# Altium schematic sheet FDCAN.SchDoc: FDCAN
size A4; Date: Not used; ApprovedBy: Not used; CheckedBy: Not used; Author: Not used; CompanyName: STMicroelectronics; DrawnBy: Not used; Engineer: Not used; Organization: Not used; Address1: Not used; Address2: Not used; Address3: Not used; Address4: Not used; DocumentNumber: Not used; Revision: Not used; SheetNumber: 12; SheetTotal: 22; CurrentTime: Not used; CurrentDate: Not used; Time: Not used; DocumentFullPathAndName: Not used; DocumentName: Not used; ModifiedDate: Not used; ImagePath: Not used; ProjectName: Not used; Application_BuildNumber: Not used
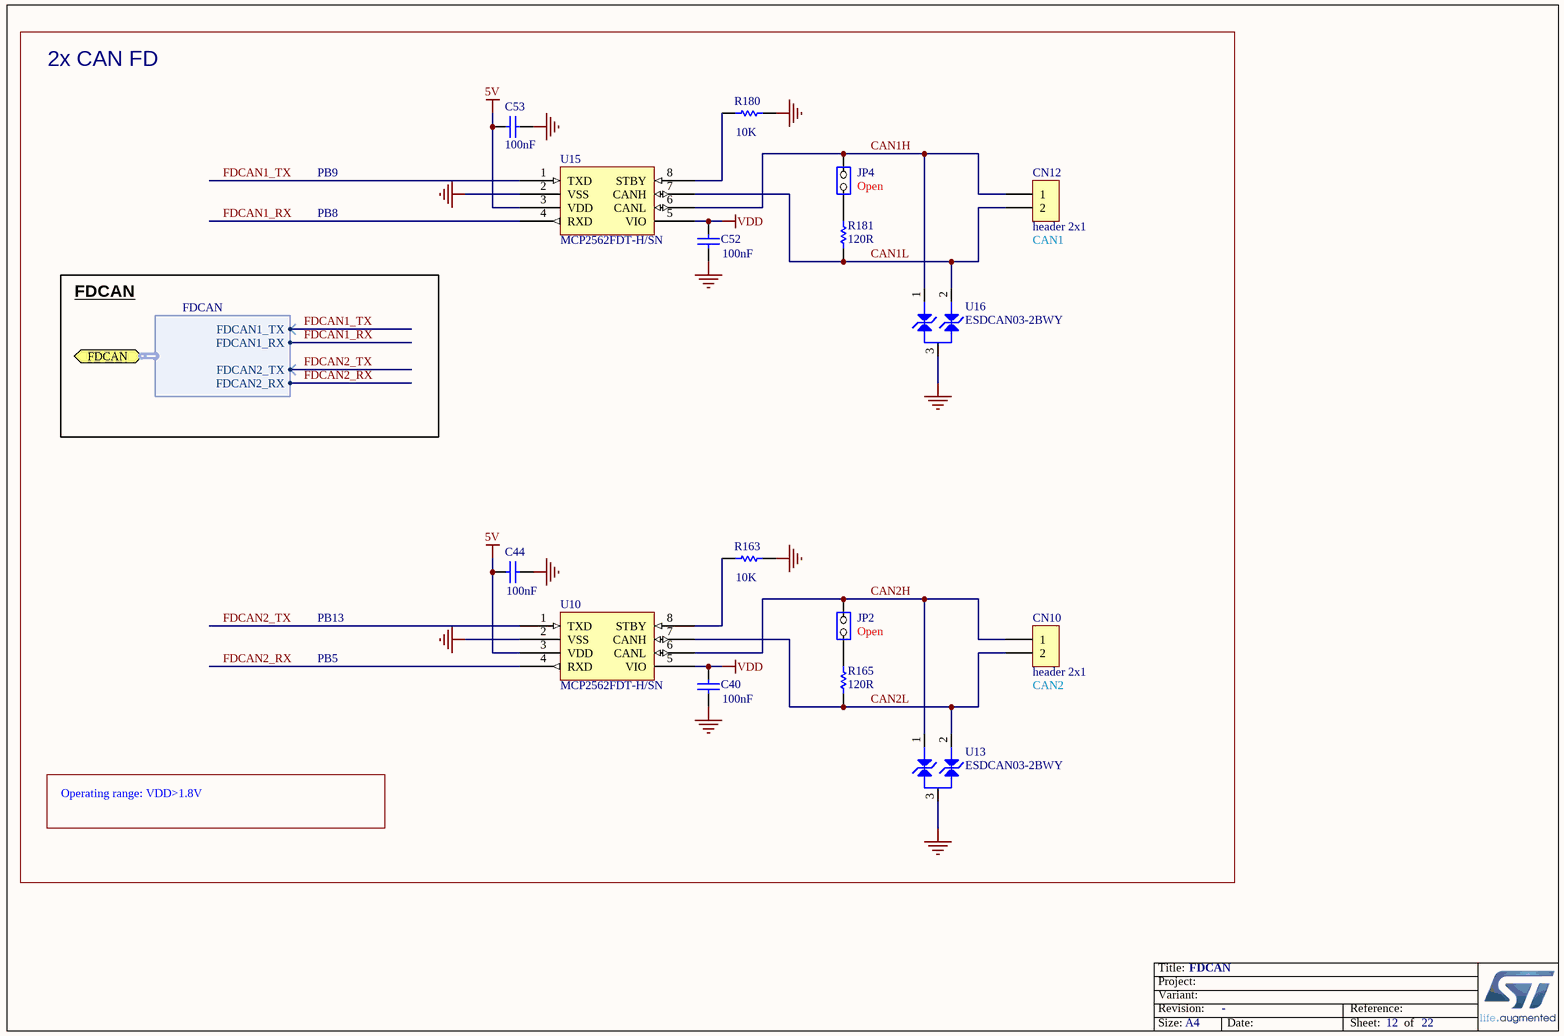
[diagram p0: FDCAN.SchDoc]

## Parts
C40  value 100nF  [C0402]  (hidden comment: Capacitor)
C44  value 100nF  [C0402]  (hidden comment: Capacitor)
C52  value 100nF  [C0402]  (hidden comment: Capacitor)
C53  value 100nF  [C0402]  (hidden comment: Capacitor)
CN10  Header 2x1  [CON_988-JIUBABA_PHFS25-11-02-G0B115-T-1]
CN12  Header 2x1  [CON_988-JIUBABA_PHFS25-11-02-G0B115-T-1]
JP2  Jumper_Header 2x1  [CON_SAMTEC_TSW-102-07-G-S]  (value not drawn)
JP4  Jumper_Header 2x1  [CON_SAMTEC_TSW-102-07-G-S]  (value not drawn)
R163  value 10K  [R0402]  (hidden comment: Resistor)
R165  value 120R  [R0603]  (hidden comment: Resistor)
R180  value 10K  [R0402]  (hidden comment: Resistor)
R181  value 120R  [R0603]  (hidden comment: Resistor)
U10  value MCP2562FDT-H/SN  [ICC_SO8_5X4_P127]  (hidden comment: MCP2562FD)
U13  value ESDCAN03-2BWY  [DIO_SOT323]  (hidden comment: ESD-TRANSIL-DUAL-BIDIR)
U15  value MCP2562FDT-H/SN  [ICC_SO8_5X4_P127]  (hidden comment: MCP2562FD)
U16  value ESDCAN03-2BWY  [DIO_SOT323]  (hidden comment: ESD-TRANSIL-DUAL-BIDIR)

## Ports
FDCAN (harness FDCAN)

## Harnesses
FDCAN: FDCAN1_TX, FDCAN1_RX, FDCAN2_TX, FDCAN2_RX

## Nets
5V: C44.1 C53.1 U10.3(VDD) U15.3(VDD)
GND: C40.2 C44.2 C52.2 C53.2 R163.2 R180.2 U10.2(VSS) U13.3 U15.2(VSS) U16.3
VDD: C40.1 C52.1 U10.5(VIO) U15.5(VIO)
CAN1H: CN12.1 JP4.2(NO) U15.6(CANL) U16.1
CAN1L: CN12.2 R181.1 U15.7(CANH) U16.2
CAN2H: CN10.1 JP2.2(NO) U10.6(CANL) U13.1
CAN2L: CN10.2 R165.1 U10.7(CANH) U13.2
FDCAN1_RX: U15.4(RXD) ; port FDCAN.FDCAN1_RX
FDCAN1_TX: U15.1(TXD) ; port FDCAN.FDCAN1_TX
FDCAN2_RX: U10.4(RXD) ; port FDCAN.FDCAN2_RX
FDCAN2_TX: U10.1(TXD) ; port FDCAN.FDCAN2_TX
NetJP2_1: JP2.1(COMMON) R165.2
NetJP4_1: JP4.1(COMMON) R181.2
NetR163_1: R163.1 U10.8(STBY)
NetR180_1: R180.1 U15.8(STBY)

## Notes on the sheet
- 2x CAN FD
- PB9
- PB8
- (near JP4) Open
- (near CN12) CAN1
- FDCAN
- PB13
- (near JP2) Open
- PB5
- (near CN10) CAN2
- Operating range: VDD>1.8V
- Title:
- Project:
- Size:
- Revision:
- Variant:
- A4
- -
- Date:
- Reference:
- Sheet:
- of

## Library data of the parts
C40 C44 C52 C53 = MCD-00006: Capacitor, MLCC, 100nF, 16V, X7R, 10%, 0402, T=0.5mm; Manufacturer_Part_Number: CC0402KRX7R7BB104; Manufacturer: YAGEO; Alternate_Manufacturer_Part_Number: GCM155R71C104KA55D; Alternate_Manufacturer: MURATA; Provided_By: SUBCO; Initial_Board_Reference: MB1274; Path: ws/MCD_ApplicationBoards/Lists/MCDPARTSdatabase; Item Type: Item; Internal_Part_Number: MCD-00006; ComponentLink1Description: Datasheet; Status: Released; Package: C0402; Part_Type: Capacitor; ComponentLink1URL: http://tunmcdsvn.tun.st.com/Component_Datasheet_Library/Trunk/Capacitors/Yageo_Multilayer_Capacitor_X7R_series_100pF_to_22uF
CN10 CN12 = MCD-00314: Header, 2x1, 2.54mm, VR, TH, Height 6mm/3mm; Part_Type: Connector; Manufacturer_Part_Number: PHFS25-11-02-G0B115-T-1; Manufacturer: JIUBABA; Provided_By: SUBCO; Initial_Board_Reference: MB1311; Path: ws/MCD_ApplicationBoards/Lists/MCDPARTSdatabase; Item Type: Item; Internal_Part_Number: MCD-00314; Value: header 2x1; Status: Released; ComponentLink1Description: Datasheet; ComponentLink1URL: http://tunmcdsvn.tun.st.com/Component_Datasheet_Library/Trunk/Connectors/Jiubaba_PHFS25_11XXXXXXXXXX
JP2 JP4 = MCD-00045: Header, 2x1, 2,54mm, VR, TH, Height 5.84mm/2.54mm; Manufacturer_Part_Number: TSW-102-07-x-S; Manufacturer: SAMTEC; Part_Type: Connector; Value: Shunt not fitted; Provided_By: SUBCO; Initial_Board_Reference: MB1274; Path: ws/MCD_ApplicationBoards/Lists/MCDPARTSdatabase; Item Type: Item; Internal_Part_Number: MCD-00045; ComponentLink1Description: Datasheet; Status: Released; ComponentLink1URL: http://tunmcdsvn.tun.st.com/Component_Datasheet_Library/Trunk/Connectors/Samtec_TSW-HTSW-series
R163 R180 = MCD-00053: Resistor,10K,0402,1%,1/16W; Manufacturer_Part_Number: RC0402FR-0710KL; Manufacturer: YAGEO; Provided_By: SUBCO; Initial_Board_Reference: MB1274; Path: ws/MCD_ApplicationBoards/Lists/MCDPARTSdatabase; Item Type: Item; Internal_Part_Number: MCD-00053; ComponentLink1Description: Datasheet; Status: Released; Part_Type: Resistor; Package: R0402; ComponentLink1URL: http://tunmcdsvn.tun.st.com/Component_Datasheet_Library/Trunk/Resistors/Yageo_Resistor_RC0402-series
R165 R181 = MCD-00338: Resistor,120R,0603,1%,1/10W; Manufacturer_Part_Number: RC0603FR-07120RL; Manufacturer: YAGEO; BMS_Part_Number: 9129734; Provided_By: SUBCO; Initial_Board_Reference: MBxxxx; Path: ws/MCD_ApplicationBoards/Lists/MCDPARTSdatabase; Item Type: Item; Internal_Part_Number: MCD-00338; Status: Released; ComponentLink1Description: Datasheet; Part_Type: Resistor; Package: R0603; ComponentLink1URL: http://tunmcdsvn.tun.st.com/Component_Datasheet_Library/Trunk/Resistors/Yageo_Resistor_RC0603-series
U10 U15 = MCD-00129: High-Speed CAN Flexible Data Rate Transceiver; Manufacturer: MICROCHIP; Part_Type: IC; Provided_By: SUBCO; Initial_Board_Reference: MB1262; Path: ws/MCD_ApplicationBoards/Lists/MCDPARTSdatabase; Item Type: Item; Internal_Part_Number: MCD-00129; Manufacturer_Part_Number: MCP2562FDT-H/SN; ComponentLink1Description: Datasheet; Status: Released; ComponentLink1URL: http://tunmcdsvn.tun.st.com/Component_Datasheet_Library/Trunk/IC/Microchip_CAN Transceiver_MCP2562FD
U13 U16 = MCD-01228: Automotive dual-line Transil, transient voltage suppressor (TVS) for CAN bus. Compliant with interfaces in automotive: CAN-FD, LIN, FlexRay, MOST, SENT, USB; Part_Type: Diode; Manufacturer: STMICROELECTRONICS; Provided_By: SUBCO with ST control; Initial_Board_Reference: MB1397; Path: ws/MCD_ApplicationBoards/Lists/MCDPARTSdatabase; Item Type: Item; Internal_Part_Number: MCD-01228; Status: Checked; Manufacturer_Part_Number: ESDCAN03-2BWY; Package: SOT323-3L; ComponentLink1Description: Datasheet; ComponentLink1URL: http://tunmcdsvn.tun.st.com/Component_Datasheet_Library/Trunk/Diodes/STM_ESD_ESDCAN02-2BWY